# Altium schematic sheet MB1315A.SchDoc: RGB LCD 4.3" with Capacitive Touch
size A4; Date: 25-FEB-2015; Author: A.B; CompanyName: STMicroelectronics; Address1: 12, Rue Jules HOROWITZ; Address2: 38019 Grenoble; Address3: FRANCE; DocumentNumber: MB1315-H7B3I; Revision: A.01; SheetNumber: 1; SheetTotal: 1; Project: STM32H7B3I-DK
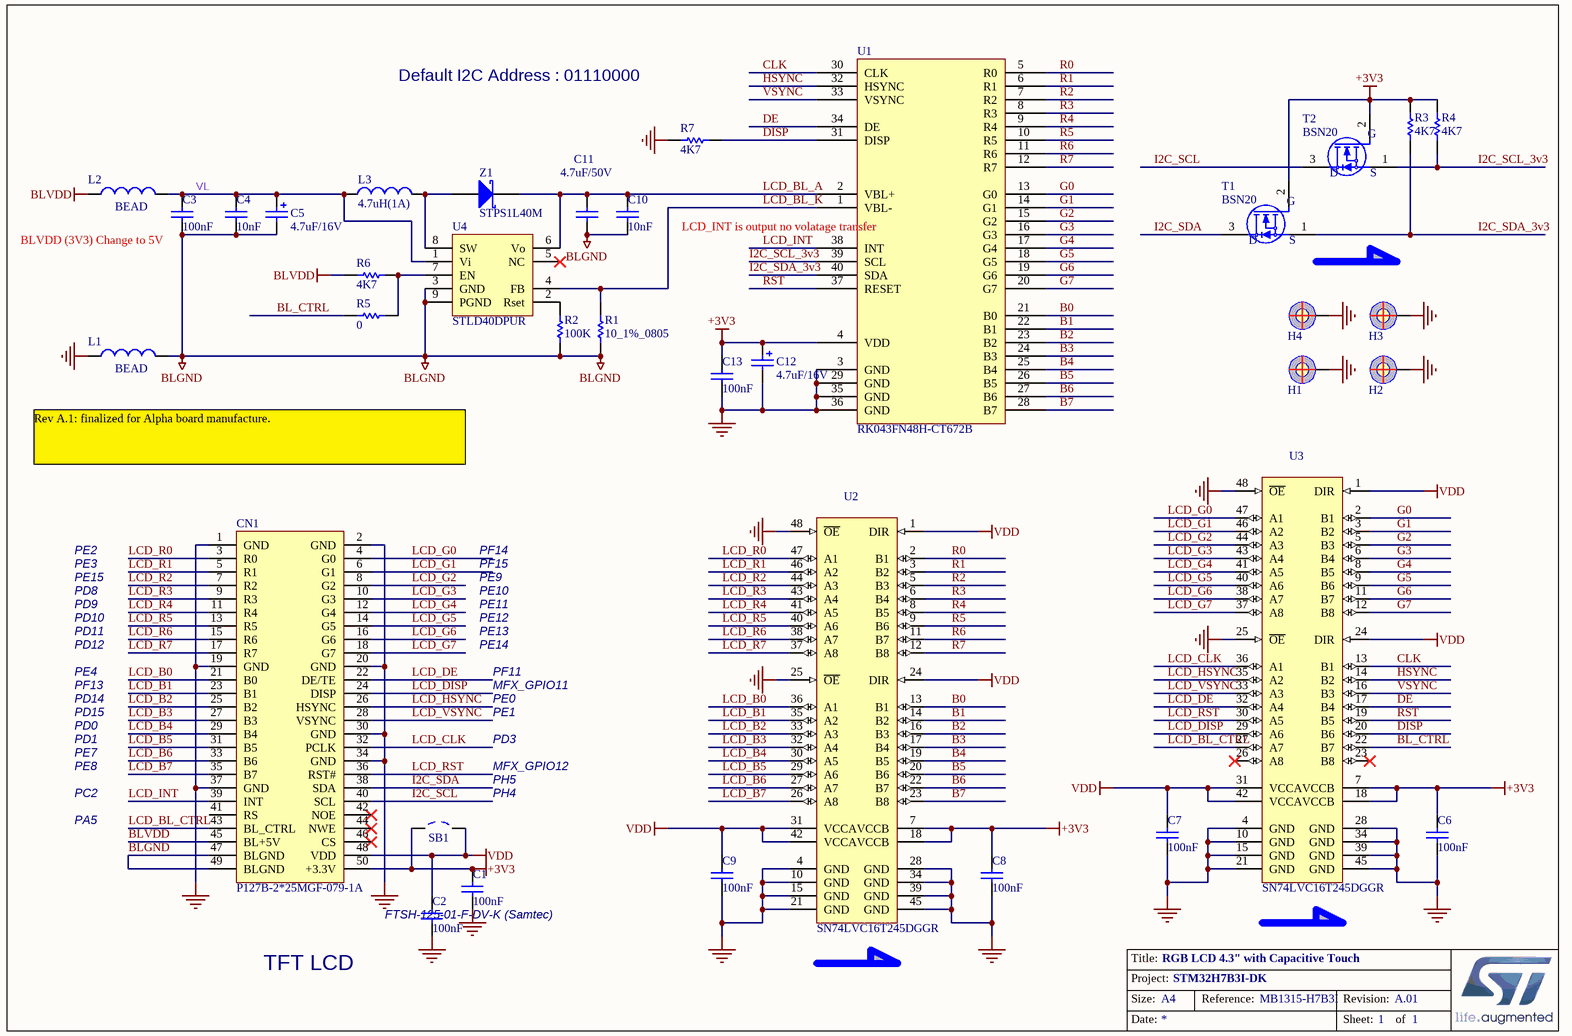
[diagram p0: MB1315A.SchDoc]

## Parts
C1  100nF  [0603C]
C2  100nF  [0603C]
C3  100nF  [0603C]
C4  10nF  [0603C]
C5  4.7uF/16V  [1206C]
C6  100nF  [0603C]
C7  100nF  [0603C]
C8  100nF  [0603C]
C9  100nF  [0603C]
C10  10nF  [0603C]
C11  4.7uF/50V  [1206C]
C12  4.7uF/16V  [1206C]
C13  100nF  [0603C]
CN1  P127B-2*25MGF-079-1A  [FTSH-125-01-F-DV]
H1  POSITION HOLE  [HOLE_C9D4R5]  (value not drawn)
H2  POSITION HOLE  [HOLE_C9D4R5]  (value not drawn)
H3  POSITION HOLE  [HOLE_C9D4R5]  (value not drawn)
H4  POSITION HOLE  [HOLE_C9D4R5]  (value not drawn)
L1  BEAD  [0603L]
L2  BEAD  [0603L]
L3  4.7uH(1A)  [1210L]
R1  10_1%_0805  [0805R]
R2  100K  [0603R]
R3  4K7  [0603R]
R4  4K7  [0603R]
R5  0  [0603R]
R6  4K7  [0603R]
R7  4K7  [0603R]
SB1  Solder Bridge OFF  [SB_0603]  (value not drawn)
T1  BSN20  [SOT23-213]
T2  BSN20  [SOT23-213]
U1  RK043FN48H-CT672B  [LCD_RK043FN48H-CT672B]
U2  SN74LVC16T245DGGR  [TSSOP48_0R5_12R5X8R1]
U3  SN74LVC16T245DGGR  [TSSOP48_0R5_12R5X8R1]
U4  STLD40DPUR  [SON8_0R65_3X3]
Z1  STPS1L40M  [DO-216AA]

## Nets
+3V3: C1.2 C6.2 C8.2 C12.1 C13.2 CN1.50(+3.3V) R3.2 R4.2 SB1.1 T1.2(G) T2.2(G) U1.4(VDD) U2.7(VCCB) U2.18(VCCB) U3.7(VCCB) U3.18(VCCB)
BLGND: C3.1 C4.1 C5.2 C10.1 C11.2 CN1.47(BLGND) CN1.49(BLGND) L1.2 R1.1 R2.1 U4.3(GND) U4.9(PGND)
BLVDD: CN1.45(BL+5V) L2.1 R6.2
GND: C1.1 C2.1 C6.1 C7.1 C8.1 C9.1 C12.2 C13.1 CN1.1(GND) CN1.2(GND) CN1.19(GND) CN1.20(GND) CN1.30(GND) CN1.34(GND) CN1.37(GND) H1.1 H2.1 H3.1 H4.1 L1.1 R7.2 U1.3(GND) U1.29(GND) U1.35(GND) U1.36(GND) U2.4(GND) U2.10(GND) U2.15(GND) U2.21(GND) U2.25(~{OE}) U2.28(GND) U2.34(GND) U2.39(GND) U2.45(GND) U2.48(~{OE}) U3.4(GND) U3.10(GND) U3.15(GND) U3.21(GND) U3.25(~{OE}) U3.28(GND) U3.34(GND) U3.39(GND) U3.45(GND) U3.48(~{OE})
VDD: C2.2 C7.2 C9.2 CN1.48(VDD) SB1.2 U2.1(DIR) U2.24(DIR) U2.31(VCCA) U2.42(VCCA) U3.1(DIR) U3.24(DIR) U3.31(VCCA) U3.42(VCCA)
B0: U1.21(B0) U2.13(B1)
B1: U1.22(B1) U2.14(B2)
B2: U1.23(B2) U2.16(B3)
B3: U1.24(B3) U2.17(B4)
B4: U1.25(B4) U2.19(B5)
B5: U1.26(B5) U2.20(B6)
B6: U1.27(B6) U2.22(B7)
B7: U1.28(B7) U2.23(B8)
BL_CTRL: R5.2 U3.22(B7)
CLK: U1.30(CLK) U3.13(B1)
DE: U1.34(DE) U3.17(B4)
DISP: R7.1 U1.31(DISP) U3.20(B6)
G0: U1.13(G0) U3.2(B1)
G1: U1.14(G1) U3.3(B2)
G2: U1.15(G2) U3.5(B3)
G3: U1.16(G3) U3.6(B4)
G4: U1.17(G4) U3.8(B5)
G5: U1.18(G5) U3.9(B6)
G6: U1.19(G6) U3.11(B7)
G7: U1.20(G7) U3.12(B8)
HSYNC: U1.32(HSYNC) U3.14(B2)
I2C_SCL: CN1.40(SCL) T2.3(D)
I2C_SCL_3v3: R4.1 T2.1(S) U1.39(SCL)
I2C_SDA: CN1.38(SDA) T1.3(D)
I2C_SDA_3v3: R3.1 T1.1(S) U1.40(SDA)
LCD_B0: CN1.21(B0) U2.36(A1)
LCD_B1: CN1.23(B1) U2.35(A2)
LCD_B2: CN1.25(B2) U2.33(A3)
LCD_B3: CN1.27(B3) U2.32(A4)
LCD_B4: CN1.29(B4) U2.30(A5)
LCD_B5: CN1.31(B5) U2.29(A6)
LCD_B6: CN1.33(B6) U2.27(A7)
LCD_B7: CN1.35(B7) U2.26(A8)
LCD_BL_A: C10.2 C11.1 U1.2(VBL+) U4.6(Vo) Z1.2(K)
LCD_BL_CTRL: CN1.43(BL_CTRL) U3.27(A7)
LCD_BL_K: R1.2 U1.1(VBL-) U4.4(FB)
LCD_CLK: CN1.32(PCLK) U3.36(A1)
LCD_DE: CN1.22(DE/TE) U3.32(A4)
LCD_DISP: CN1.24(DISP) U3.29(A6)
LCD_G0: CN1.4(G0) U3.47(A1)
LCD_G1: CN1.6(G1) U3.46(A2)
LCD_G2: CN1.8(G2) U3.44(A3)
LCD_G3: CN1.10(G3) U3.43(A4)
LCD_G4: CN1.12(G4) U3.41(A5)
LCD_G5: CN1.14(G5) U3.40(A6)
LCD_G6: CN1.16(G6) U3.38(A7)
LCD_G7: CN1.18(G7) U3.37(A8)
LCD_HSYNC: CN1.26(HSYNC) U3.35(A2)
LCD_INT: CN1.39(INT) U1.38(INT)
LCD_R0: CN1.3(R0) U2.47(A1)
LCD_R1: CN1.5(R1) U2.46(A2)
LCD_R2: CN1.7(R2) U2.44(A3)
LCD_R3: CN1.9(R3) U2.43(A4)
LCD_R4: CN1.11(R4) U2.41(A5)
LCD_R5: CN1.13(R5) U2.40(A6)
LCD_R6: CN1.15(R6) U2.38(A7)
LCD_R7: CN1.17(R7) U2.37(A8)
LCD_RST: CN1.36(RST#) U3.30(A5)
LCD_VSYNC: CN1.28(VSYNC) U3.33(A3)
R0: U1.5(R0) U2.2(B1)
R1: U1.6(R1) U2.3(B2)
R2: U1.7(R2) U2.5(B3)
R3: U1.8(R3) U2.6(B4)
R4: U1.9(R4) U2.8(B5)
R5: U1.10(R5) U2.9(B6)
R6: U1.11(R6) U2.11(B7)
R7: U1.12(R7) U2.12(B8)
RST: U1.37(RESET) U3.19(B5)
VL: C3.2 C4.2 C5.1 L2.2 L3.1 U4.1(Vi)
VSYNC: U1.33(VSYNC) U3.16(B3)
NetL3_2: L3.2 U4.8(SW) Z1.1(A)
NetR2_2: R2.2 U4.2(Rset)
NetR5_1: R5.1 R6.1 U4.7(EN)

Not connected (* = marked no-connect by the designer): CN1 41(RS) 42(NOE)* 44(NWE)* 46(CS)*; U3 23(B8)* 26(A8)*; U4 5(NC)*

## Notes on the sheet
- Default I2C Address : 01110000
- (near C3) BLVDD (3V3) Change to 5V
- (near U1) LCD_INT is output no volatage transfer
- Rev A.1: finalized for Alpha board manufacture.
- PE2
- PE3
- PE15
- PF14
- PF15
- PE9
- PD8
- PD9
- PD10
- PD11
- PD12
- PE10
- PE11
- PE12
- PE13
- PE14
- PE4
- PF13
- PD14
- PD15
- PF11
- PE0
- PE1
- MFX_GPIO11
- PD0
- PD1
- PE7
- PE8
- PD3
- PH5
- MFX_GPIO12
- PC2
- PA5
- (near SB1) PH4
- FTSH-125-01-F-DV-K (Samtec)
- TFT LCD
- Title:
- Project:
- Size:
- Date:
- A4
- Reference:
- Sheet:
- Revision:
- of

## Library data of the parts
C1 C2 C6-C9 C13 = CAP: Capacitor; Value: 100pF; Ordered by: Subcon; ECCN_US/EU: NA; Published: 8-Jun-2000; Revision: July-2002: Re-released for DXP Platform.; Publisher: Altium Limited
C3 = Cap_100nF_X7R_10%_0603: Capacitor,100nF,16V,X7R,10%,0603,YAGEO; Manuf_Part_1: CC0603KRX7R9BB104; Revision: July-2002: Re-released for DXP Platform.; Value: 100nF; Order: CC0603KRX7R9BB104; Manuf_1: YAGEO; ECCN_US/EU: n/a
C4 C10 = Cap_10nF_X7R_10%_0603: Capacitor,10nF,50V,X7R,10%,0603,YAGEO; Manuf_Part_1: CC0603KRX7R9BB103; Revision: July-2002: Re-released for DXP Platform.; Value: 10nF; Order: CC0603KRX7R9BB103; Manuf_1: YAGEO; ECCN_US/EU: n/a
C5 C12 = Cap Pol1: Polarized Capacitor (Radial); Value: 100pF; Ordered by: Subcon; ECCN_US/EU: NA; Published: 8-Jun-2000; Revision: July-2002: Re-released for DXP Platform.; Publisher: Altium Limited
C11 = CAP: Capacitor; Ordered by: Subcon; ECCN_US/EU: NA; Published: 8-Jun-2000; Revision: July-2002: Re-released for DXP Platform.; Publisher: Altium Limited; Value: 4.7uF/50V
CN1 = Header 25X2: TFT LCD connector; Revision: 17-Jul-2002: Re-released for DXP Platform.; Publisher: Altium Limited
H1-H4 = POSITION HOLE: Fitted: NO
L1 L2 = Inductor: Manuf_1: Tai-tech; Manuf_Part_1: FCM1608KF-601T03; Value: 100uH; Ordered by: Subcon; ECCN_US/EU: NA; Published: 8-Jun-2000; Revision: July-2002: Re-released for DXP Platform.; Publisher: Altium Limited
L3 = Inductor: Manuf_1: Murata; Manuf_Part_1: LQH32PN4R7NN0L; Ordered by: Subcon; ECCN_US/EU: NA; Revision: V1.0; Value: 4.7uH(1A)
R1 = Res_10_1%_0805: Resistor,10,0805,1%,Stackpole,1/4W; Manuf_Part_1: RNCP0805FTD10R0; Manuf_1: Stackpole Electronics Inc; Value: 10; Order: RNCP0805FTD10R0; ECCN_US/EU: n/a
R2 = Res_1K_1%_0603: Resistor,100K,0603,1%,YAGEO; Ordered by: Subcon; Fitted: YES; Value: 100K; Manuf_1: YAGEO; ECCN_US/EU: n/a
R3 R4 R6 R7 = Res_1K_1%_0603: Resistor,4.7K,0603,1%,YAGEO; Ordered by: Subcon; Fitted: YES; Value: 4K7; Manuf_1: YAGEO; ECCN_US/EU: n/a
R5 = Res_1K_1%_0603: Resistor,0K,0603,1%,YAGEO; Ordered by: Subcon; Fitted: YES; Value: 0; Manuf_1: YAGEO; ECCN_US/EU: n/a
SB1 = SB_OFF: Fitted: NO; Ordered by: Subcon; Revision: July-2002: Re-released for DXP Platform.; ECCN_US/EU: n/a
T1 T2 = 2N7000
U1 = RK043FN48H-CT672B: 4.3 inch TFT 480*272 pixels with LED Backlight and Capacitive touch panel, high luminance; Manuf_1: Rocktech Displays Limited; ECCN_US/EU: EAR99/NEC; Manuf_Part_1: RK043FN48H-CT672B; Distrib: Sub Co; Ref St: *
U2 U3 = SN74LVC16T245: Manuf_1: TI; Ordered by: Subcon; ECCN_US/EU: EAR99/NEC; Manuf_Part_1: SN74LVC16T245DGGR
U4 = STLD40DPUR: White LED power supply for large display backlight, QFN8; Ordered by: STM; ECCN_US/EU: EAR99/NEC; Ref St: xxxxxxxxx; Provided: ST; Manuf_Part_1: STLD40DPUR; Manuf_1: STM; Distrib: ST
Z1 = D Schottky: Schottky Diode; Code - JEDEC: DO-214-AA; Ordered by: STM; Ref St: 9151085; ECCN_US/EU: EAR99/NEC; Published: 8-Jun-2000; Revision: July-2002: Re-released for DXP Platform.; Publisher: Altium Limited; Manuf_1: STM; Manuf_Part_1: STPS1L40M